# Altium schematic sheet adc-circuit-ADS7952.SchDoc: ADS7952 Circuit
size A4; DrawnBy: Dylan Vogel; Organization: UTAT SS; Revision: 1.1
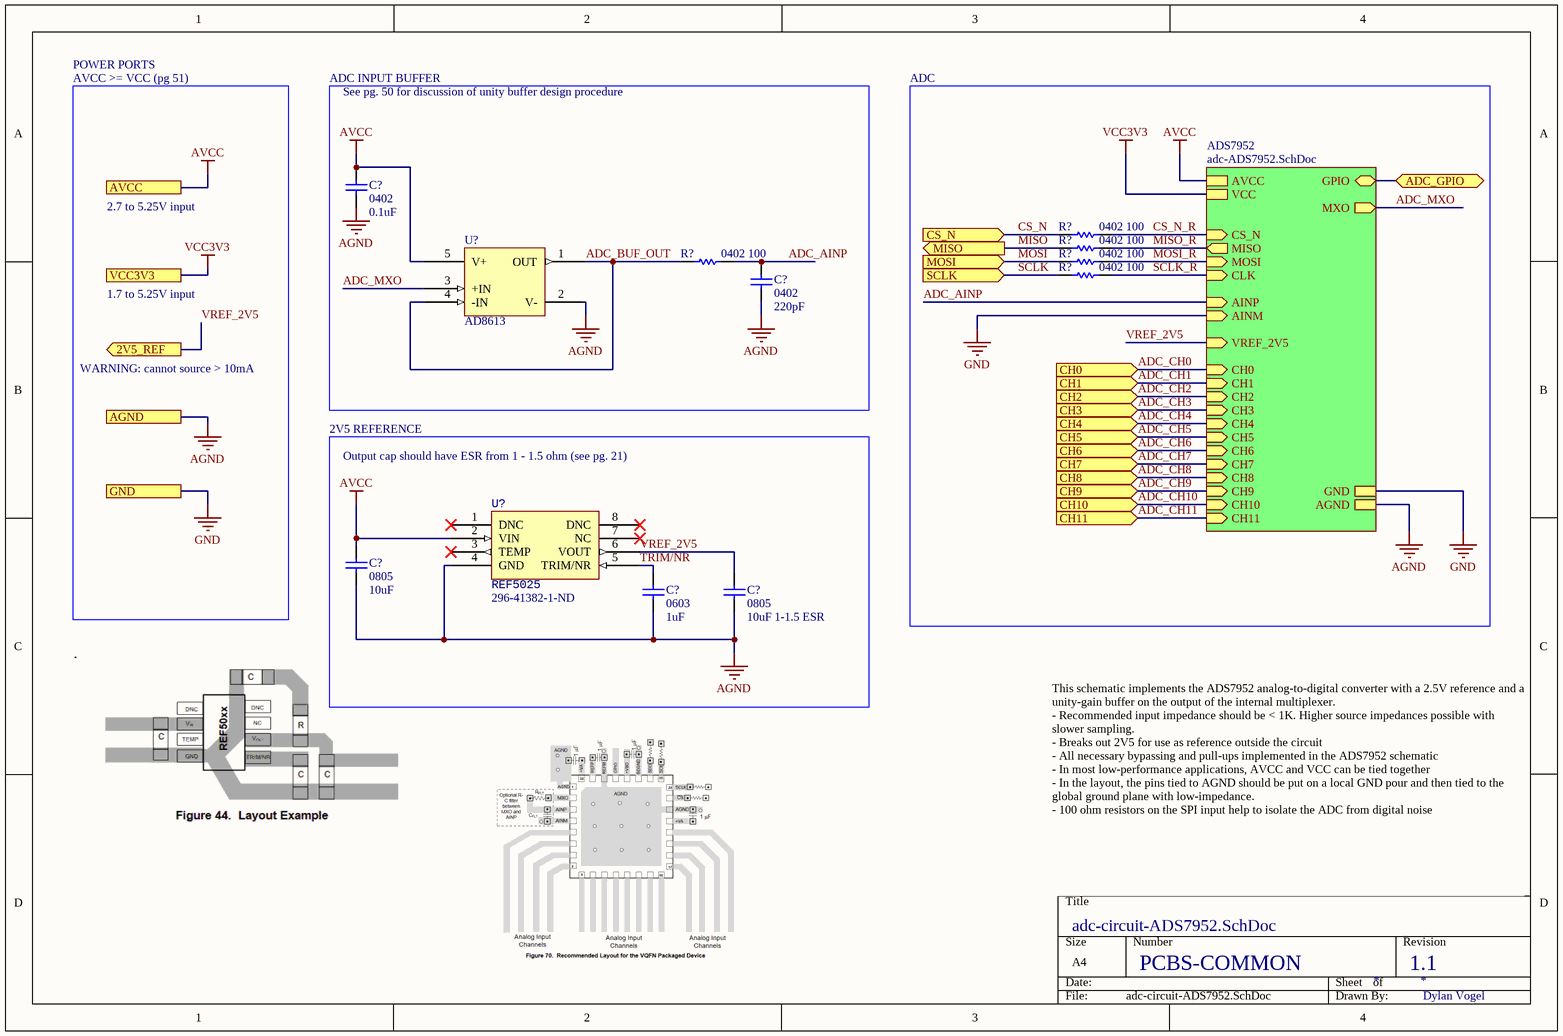
[diagram p0: adc-circuit-ADS7952.SchDoc]

## Parts
(Parts that share a designator on the sheet are numbered #1, #2 ... from top to bottom, then left to right.)
C?#1  0402  value 0.1uF  [CAP0402R]
C?#2  0402  value 220pF  [CAP0402R]
C?#3  0805  value 10uF  [CAP0805R]
C?#4  0603  value 1uF  [CAP0603R]
C?#5  0805  value 10uF 1-1.5 ESR  [CAP0805R]
R?#1  0402  value 100  [RES0402R]
R?#2  0402  value 100  [RES0402R]
R?#3  0402  value 100  [RES0402R]
R?#4  0402  value 100  [RES0402R]
R?#5  0402  value 100  [RES0402R]
U?#1  AD8613  [SOP65P200X125-5N]
U?#2  REF5025  Supplier Part Number 1: 296-41382-1-ND  [SOP65P300X125-8N]

## Blocks framed on the sheet
ADC: R?#1 R?#2 R?#4 R?#5

## Sub-sheets
ADS7952 = adc-ADS7952.SchDoc: CH8 (in), CH2 (in), CH11 (in), CH10 (in), CH9 (in), CH6 (in), CH3 (in), CH7 (in), CH5 (in), CH4 (in), CH0 (in), CH1 (in), AVCC, GND, VCC, AGND, CLK (in), MISO (out), MOSI (in), CS_N (in), GPIO (bidir), AINP (in), VREF_2V5 (in), MXO (out), AINM (in)  | C1: =C6; C2: =C7; C3: =C8; C4: =C9; R1: =R6

## Ports
2V5_REF (out), ADC_GPIO (bidir), AGND, AVCC, CH0 (in), CH1 (in), CH2 (in), CH3 (in), CH4 (in), CH5 (in), CH6 (in), CH7 (in), CH8 (in), CH9 (in), CH10 (in), CH11 (in), CS_N (in), GND, MISO (out), MOSI (in), SCLK (in), VCC3V3

## Nets
AGND: C?#1.1 C?#2.1 C?#3.1 C?#4.1 C?#5.1 U?#1.2(V-) U?#2.4(GND) ; port AGND, sheet ADS7952/AGND
AVCC: C?#1.2 C?#3.2 U?#1.5(V+) U?#2.2(VIN) ; port AVCC, sheet ADS7952/AVCC
GND: port GND, sheet ADS7952/GND, sheet ADS7952/AINM
VCC3V3: port VCC3V3, sheet ADS7952/VCC
ADC_AINP: C?#2.2 R?#3.2 ; sheet ADS7952/AINP
ADC_BUF_OUT: R?#3.1 U?#1.1(OUT) U?#1.4(-IN)
ADC_CH0: port CH0, sheet ADS7952/CH0
ADC_CH1: port CH1, sheet ADS7952/CH1
ADC_CH2: port CH2, sheet ADS7952/CH2
ADC_CH3: port CH3, sheet ADS7952/CH3
ADC_CH4: port CH4, sheet ADS7952/CH4
ADC_CH5: port CH5, sheet ADS7952/CH5
ADC_CH6: port CH6, sheet ADS7952/CH6
ADC_CH7: port CH7, sheet ADS7952/CH7
ADC_CH8: port CH8, sheet ADS7952/CH8
ADC_CH9: port CH9, sheet ADS7952/CH9
ADC_CH10: port CH10, sheet ADS7952/CH10
ADC_CH11: port CH11, sheet ADS7952/CH11
ADC_GPIO: port ADC_GPIO, sheet ADS7952/GPIO
ADC_MXO: U?#1.3(+IN) ; sheet ADS7952/MXO
CS_N: R?#1.1 ; port CS_N
CS_N_R: R?#1.2 ; sheet ADS7952/CS_N
MISO: R?#2.1 ; port MISO
MISO_R: R?#2.2 ; sheet ADS7952/MISO
MOSI: R?#4.1 ; port MOSI
MOSI_R: R?#4.2 ; sheet ADS7952/MOSI
SCLK: R?#5.1 ; port SCLK
SCLK_R: R?#5.2 ; sheet ADS7952/CLK
TRIM/NR: C?#4.2 U?#2.5(TRIM/NR)
VREF_2V5: C?#5.2 U?#2.6(VOUT) ; port 2V5_REF, sheet ADS7952/VREF_2V5

Not connected (* = marked no-connect by the designer): U?#2 1(DNC)* 3(TEMP)* 7(NC)* 8(DNC)*

## Notes on the sheet
- POWER PORTS
- AVCC >= VCC (pg 51)
- ADC INPUT BUFFER
- See pg. 50 for discussion of unity buffer design procedure
- 2.7 to 5.25V input
- 1.7 to 5.25V input
- WARNING: cannot source > 10mA
- 2V5 REFERENCE
- Output cap should have ESR from 1 - 1.5 ohm (see pg. 21)
- This schematic implements the ADS7952 analog-to-digital converter with a 2.5V reference and a unity-gain buffer on the output of the internal multiplexer.
  - Recommended input impedance should be < 1K. Higher source impedances possible with slower sampling.
  - Breaks out 2V5 for use as reference outside the circuit
  - All necessary bypassing and pull-ups implemented in the ADS7952 schematic
  - In most low-performance applications, AVCC and VCC can be tied together
  - In the layout, the pins tied to AGND should be put on a local GND pour and then tied to the global ground plane with low-impedance.
  - 100 ohm resistors on the SPI input help to isolate the ADC from digital noise
- PCBS-COMMON

## Library data of the parts
C?#1 = CAP0402: 0402 capacitor; Manufacturer: Taiyo Yuden; Manufacturer Part Number: EMK105B7104KVHF; Voltage Rating: 16V; Capacitance: 100nF; Tolerance: 10%; Dielectric: X7R; Supplier 1: Digi-Key; Supplier Part Number 1: 587-3807-1-ND; Stock 1: 18196; Pricing 1: 1=0.1, 10=0.057, 100=0.0254, 500=0.01812, 1000=0.01423, 2500=0.01294, 5000=0.0119 (USD); Mount: Surface Mount; Case/Package: 0402; Weight: 2.3E-05oz; Case Code (Metric): 1005; Case Code (Imperial): 0402; Min Operating Temperature: -55°C; Max Operating Temperature: 125°C; Package Quantity: 10000; Packaging: Tape and Reel; Termination: SMD/SMT; Voltage Rating (DC): 16V; Length: 0.039inch; Height: 0.5mm; Width: 0.02inch; Thickness: 0.022inch; Ratings: AEC-Q200; Lead Free: Lead Free; Halogen Free: Halogen Free
C?#2 = CAP0402: 0402 capacitor; Manufacturer: Murata; Manufacturer Part Number: GCM155R71H221KA37D; Tolerance: 10%; Voltage Rating: 50V; Dielectric: X7R; Supplier 1: Digi-Key; Supplier Part Number 1: 490-4912-1-ND; Stock 1: 141569; Pricing 1: 1=0.1, 10=0.059, 100=0.0264, 500=0.01884, 1000=0.0148, 2500=0.01346, 5000=0.01238 (USD); Mount: Surface Mount; Case/Package: 0402; Case Code (Imperial): 0402; Case Code (Metric): 1005; Min Operating Temperature: -55°C; Max Operating Temperature: 125°C; Capacitance: 220pF; Package Quantity: 1; Packaging: Tape and Reel; Termination: SMD/SMT; Voltage: 50V; Voltage Rating (DC): 50V; Length: 1mm; Height: 0.5mm; Width: 0.02inch; Thickness: 0.022inch; Depth: 0.5mm; Ratings: AEC-Q200; Radiation Hardening: No; ComponentLink1URL: http://psearch.murata.com/capacitor/product/GCM155R71H221KA37%23.pdf?src-supplier=Avnet+Europe; ComponentLink1Description: http://psearch.murata.com/capacitor/product/GCM155R71H221KA37%23.pdf?src-supplier=Avnet+Europe; ComponentLink2URL: http://search.murata.co.jp/Ceramy/image/img/A01X/partnumbering_e_02.pdf?src-supplier=Digi-Key; ComponentLink2Description: http://search.murata.co.jp/Ceramy/image/img/A01X/partnumbering_e_02.pdf?src-supplier=Digi-Key; ComponentLink3URL: https://www.murata.com/~/media/webrenewal/support/library/catalog/products/capacitor/mlcc/c03e.ashx?src-supplier=Avnet; ComponentLink3Description: https://www.murata.com/~/media/webrenewal/support/library/catalog/products/capacitor/mlcc/c03e.ashx?src-supplier=Avnet
C?#3 = CAP0805: 0805 capacitor; Manufacturer: Murata; Manufacturer Part Number: GCM21BR70J106KE22K; Tolerance: 10%; Dielectric: X7R; Voltage Rating (DC): 6.3V; Supplier 1: Digi-Key; Supplier Part Number 1: 490-14361-1-ND; Stock 1: 214938; Pricing 1: 1=0.42, 10=0.29, 100=0.1742, 500=0.13064, 1000=0.11031, 2500=0.10451, 5000=0.0987 (USD); Case/Package: 0805; Min Operating Temperature: -55°C; Max Operating Temperature: 125°C; Capacitance: 10uF; Packaging: Tape and Reel; Length: 2mm; Depth: 1.25mm; Lead Free: Lead Free
C?#4 = CAP0603: 0603 capacitor; Manufacturer: KEMET; Manufacturer Part Number: C0603C105K4RACAUTO; Tolerance: 10%; Voltage Rating: 16V; Supplier 1: Digi-Key; Supplier Part Number 1: 399-17704-1-ND; Stock 1: 376276; Pricing 1: 1=0.17, 10=0.12, 100=0.0564, 500=0.03952, 1000=0.03273 (USD); Mount: Surface Mount; Case/Package: 0603; Case Code (Imperial): 0603; Case Code (Metric): 1608; Min Operating Temperature: -55°C; Max Operating Temperature: 125°C; Packaging: Cut Tape; Capacitance: 1uF; Ratings: AEC-Q200
C?#5 = CAP0805: 0805 capacitor; Manufacturer: Murata; Manufacturer Part Number: GCM21BR70J106KE22K; Capacitance: 10uF; Tolerance: 10%; Dielectric: X7R; Voltage Rating (DC): 6.3V; Supplier 1: Digi-Key; Supplier Part Number 1: 490-14361-1-ND; Stock 1: 214938; Pricing 1: 1=0.42, 10=0.29, 100=0.1742, 500=0.13064, 1000=0.11031, 2500=0.10451, 5000=0.0987 (USD); Case/Package: 0805; Min Operating Temperature: -55°C; Max Operating Temperature: 125°C; Packaging: Tape and Reel; Length: 2mm; Depth: 1.25mm; Lead Free: Lead Free
R?#1-R?#5 = RES0402: 0402 resistor; Manufacturer: Vishay Dale; Manufacturer Part Number: CRCW0402100RFKEDHP; Resistance: 100R; Tolerance: 1%; Power Rating: 125mW; Voltage Rating: 50V; Temperature Coefficient: 100ppm/°C; Supplier 1: Digi-Key; Supplier Part Number 1: 541-100YCT-ND; Stock 1: 530594; Pricing 1: 1=0.15, 10=0.138, 100=0.0532, 1000=0.02343, 2500=0.02023, 5000=0.0181 (USD); Mount: Surface Mount; Case/Package: 0402; Weight: 2.3E-05oz; Case Code (Imperial): 0402; Case Code (Metric): 1005; Contact Plating: Tin; Min Operating Temperature: -55°C; Max Operating Temperature: 155°C; Packaging: Tape and Reel; Package Quantity: 10000; Termination: SMD/SMT; Composition: Thick Film; Voltage Rating (DC): 50V; Length: 1mm; Height: 0.3mm; Width: 0.5mm; Depth: 0.5mm; Radiation Hardening: No; REACH SVHC: Unknown; Lead Free: Lead Free; ComponentLink1URL: http://www.vishay.com/docs/20043/crcwhpe3.pdf?src-supplier=Avnet; ComponentLink1Description: http://www.vishay.com/docs/20043/crcwhpe3.pdf?src-supplier=Avnet
U?#1 = AD8613: Low power, low noise rail-to-rail op-amp.; Supplier 1: Digi-Key; Supplier Part Number 1: AD8613AKSZ-REEL7CT-ND
U?#2 = REF5025: Voltage Reference; Supplier 1: Digi-Key